# EAGLE design iot-tracker-A (EAGLE 9.4.2)
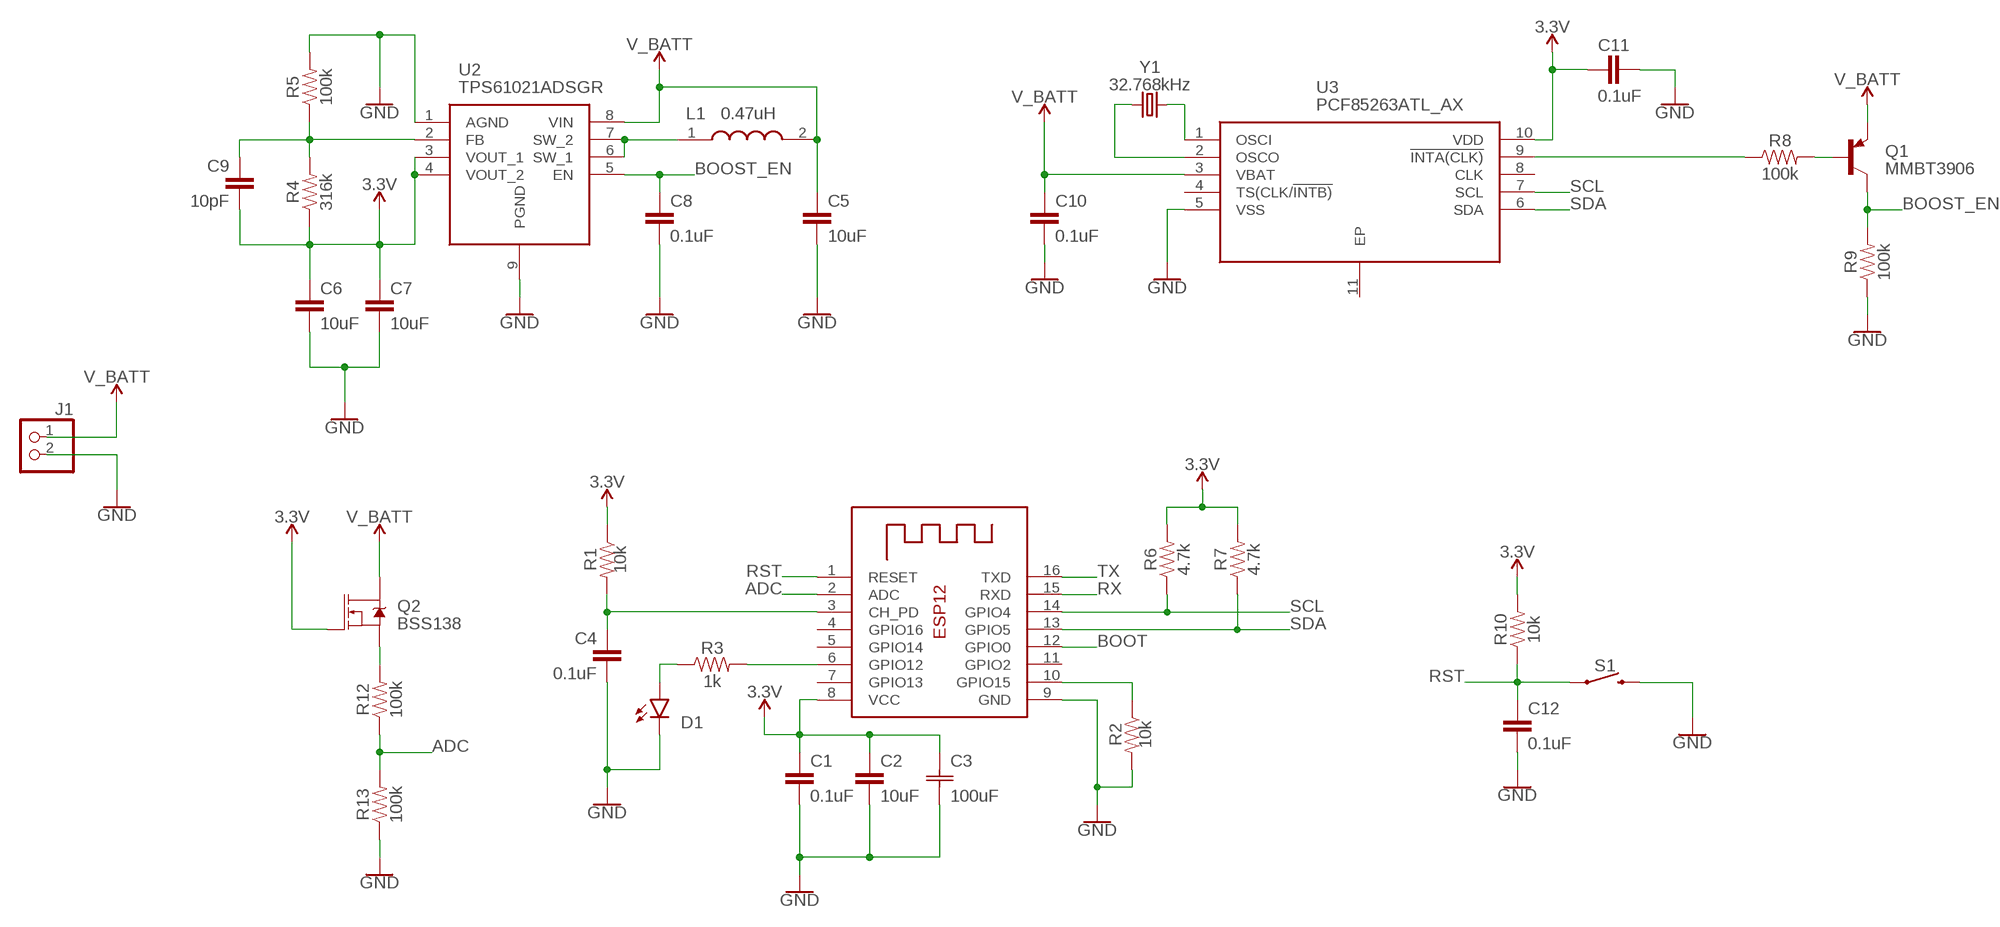
[diagram p0: schematic, sheet 1]

## Parts
C1  0.1uF  0.1UF-0603-25V-(+80/-20%)  [0603]
C2  10uF  10UF-0603-6.3V-20%  [0603]
C3  100uF  F930J107MBA  [F93-C]
C4  0.1uF  0.1UF-0603-25V-(+80/-20%)  [0603]
C5  10uF  10UF-0603-6.3V-20%  [0603]
C6  10uF  10UF-0603-6.3V-20%  [0603]
C7  10uF  10UF-0603-6.3V-20%  [0603]
C8  0.1uF  0.1UF-0603-25V-(+80/-20%)  [0603]
C9  10pF  10PF-0603-50V-5%  [0603]
C10  0.1uF  0.1UF-0603-25V-(+80/-20%)  [0603]
C11  0.1uF  0.1UF-0603-25V-(+80/-20%)  [0603]
C12  0.1uF  0.1UF-0603-25V-(+80/-20%)  [0603]
D1  LED0603  [LED-0603]
J1  PINHD-1X2  [1X02]
L1  0.47uH  DFE252012P-R47M=P2  [INDC2520X120N]
Q1  MMBT3906  MMBT3906LT1SMD  [SOT23-BEC]
Q2  BSS138  MOSFET-NCH-BSS138  [SOT23-3]
R1  10k  10KOHM-0603-1/10W-1%  [0603]
R2  10k  10KOHM-0603-1/10W-1%  [0603]
R3  1k  1KOHM-0603-1/10W-1%  [0603]
R4  316k  300KOHM-0603-1/10W-1%  [0603]
R5  100k  100KOHM-0603-1/10W-1%  [0603]
R6  4.7k  4.7KOHM-0603-1/10W-1%  [0603]
R7  4.7k  4.7KOHM-0603-1/10W-1%  [0603]
R8  100k  100KOHM-0603-1/10W-1%  [0603]
R9  100k  100KOHM-0603-1/10W-1%  [0603]
R10  10k  10KOHM-0603-1/10W-1%  [0603]
R12  100k  100KOHM-0603-1/10W-1%  [0603]
R13  100k  100KOHM-0603-1/10W-1%  [0603]
S1  MOMENTARY-SWITCH-SPST-SMD-4.6X2.8MM  [TACTILE_SWITCH_SMD_4.6X2.8MM]
U1  ESP-12  [ESP-12]
U2  TPS61021ADSGR  [SON50P200X200X80-9N]
U3  PCF85263ATL_AX  [SON50P260X260X50-11N]
Y1  32.768kHz  CRYSTAL-32.768KHZSMD-3.2X1.5  [CRYSTAL-SMD-3.2X1.5MM]

## Nets
3.3V [POWER]: C1.1 C2.1 C3.1 C6.1 C7.1 C9.2 C11.2 Q2.1(G) R1.1 R4.1 R6.2 R7.2 R10.2 U1.8(VCC) U2.3(VOUT_1) U2.4(VOUT_2) U3.10(VDD)
ADC: R12.1 R13.2 U1.2(ADC)
BOOST_EN [SIGNAL]: C8.1 Q1.C R9.2 U2.5(EN)
BOOT [SIGNAL]: U1.12(GPIO0)
ESP_EN [SIGNAL]: C4.1 R1.2 U1.3(CH_PD)
FB: C9.1 R4.2 R5.1 U2.2(FB)
GND [POWER]: C1.2 C2.2 C3.2 C4.2 C5.2 C6.2 C7.2 C8.2 C10.2 C11.1 C12.2 D1.C J1.2 R2.2 R5.2 R9.1 R13.1 S1.3 S1.4 U1.9(GND) U2.1(AGND) U2.9(PGND) U3.5(VSS)
INTA: R8.1 U3.9(!INTA(CLK))
IO15: R2.1 U1.10(GPIO15)
IO_LED: R3.2 U1.6(GPIO12)
LED_AN: D1.A R3.1
MOSFET_S: Q2.2(S) R12.2
OSCI: U3.1(OSCI) Y1.P$2
OSCO: U3.2(OSCO) Y1.P$1
PNP_B: Q1.B R8.2
RST [SIGNAL]: C12.1 R10.1 S1.1 S1.2 U1.1(RESET)
RX [DATA]: U1.15(RXD)
SCL: R6.1 U1.14(GPIO4) U3.7(SCL)
SDA: R7.1 U1.13(GPIO5) U3.6(SDA)
SW: L1.1 U2.6(SW_1) U2.7(SW_2)
TX [DATA]: U1.16(TXD)
V_BATT [POWER]: C5.1 C10.1 J1.1 L1.2 Q1.E Q2.3(D) U2.8(VIN) U3.3(VBAT)
Unconnected: U1.4(GPIO16) U1.5(GPIO14) U1.7(GPIO13) U1.11(GPIO2) U3.4(TS(CLK/!INTB)) U3.8(CLK) U3.11(EP)

## Library data of the parts
C1 C4 C8 C10-C12 = SparkFun-Capacitors:0.1UF: 0.1µF ceramic capacitors A capacitor is a passive two-terminal electrical component used to store electrical energy temporarily in an electric field.; PROD_ID: CAP-00810
C2 C5-C7 = SparkFun-Capacitors:10UF: 10.0µF ceramic capacitors A capacitor is a passive two-terminal electrical component used to store electrical energy temporarily in an electric field.; PROD_ID: CAP-11015
C3 = IOT-Tracker-A:F930J107MBA; MANUFACTURER_PART_NUMBER: F930J107MBA; VENDOR: AVX Corporation
C9 = SparkFun-Capacitors:10PF: 10pF ceramic capacitors A capacitor is a passive two-terminal electrical component used to store electrical energy temporarily in an electric field.; PROD_ID: CAP-11812
D1 = SparkFun-LED:LED: LED (Generic) Standard schematic elements and footprints for 5mm, 3mm, 1206, and 0603 sized LEDs. Generic LEDs with no color specified.
J1 = pinhead:PINHD-1X2: PIN HEADER
L1 = IOT-Tracker-A:DFE252012P-R47M=P2: Toko DFE252012P Series Shielded Wire-wound SMD Inductor with a Powered Iron Core, 470 nH Wire-Wound 6.4A Idc Source: Datasheet <https://componentsearchengine.com/Datasheets/1/DFE252012P-R47M=P2.pdf>; DESCRIPTION: Toko DFE252012P Series Shielded Wire-wound SMD Inductor with a Powered Iron Core, 470 nH Wire-Wound 6.4A Idc; HEIGHT: 1.2mm; MANUFACTURER_NAME: Murata Electronics; MANUFACTURER_PART_NUMBER: DFE252012P-R47M=P2; MOUSER_PART_NUMBER: 81-DFE252012P-R47MP2; MOUSER_PRICE-STOCK: https://www.mouser.com/Search/Refine.aspx?Keyword=81-DFE252012P-R47MP2
Q1 = transistor-pnp:MMBT3906*: PNP Transistror
Q2 = SparkFun-DiscreteSemi:MOSFET-NCH: N-channel MOSFETs Voltage controlled devices that allow control of high current outputs. SparkFun Products: SparkFun OpenScale <https://www.sparkfun.com/products/13261> SparkFun Digital Sandbox <https://www.sparkfun.com/products/12651> SparkFun Monster Moto Shield <https://www.sparkfun.com/products/10182> SparkFun MOSFET Power Controller <https://www.sparkfun.com/products/11214>; PROD_ID: TRANS-00830; VALUE: 220mA/50V/3.5Ω
R1 R2 R10 = SparkFun-Resistors:10KOHM: 10kΩ resistor A resistor is a passive two-terminal electrical component that implements electrical resistance as a circuit element. Resistors act to reduce current flow, and, at the same time, act to lower voltage levels within circuits. - Wikipedia; PROD_ID: RES-00824
R3 = SparkFun-Resistors:1KOHM: 1kΩ resistor A resistor is a passive two-terminal electrical component that implements electrical resistance as a circuit element. Resistors act to reduce current flow, and, at the same time, act to lower voltage levels within circuits. - Wikipedia; PROD_ID: RES-07856
R4 = SparkFun-Resistors:300KOHM: 300kΩ resistor A resistor is a passive two-terminal electrical component that implements electrical resistance as a circuit element. Resistors act to reduce current flow, and, at the same time, act to lower voltage levels within circuits. - Wikipedia; PROD_ID: RES-10809; VALUE: 300k
R5 R8 R9 R12 R13 = SparkFun-Resistors:100KOHM: 100kΩ resistor A resistor is a passive two-terminal electrical component that implements electrical resistance as a circuit element. Resistors act to reduce current flow, and, at the same time, act to lower voltage levels within circuits. - Wikipedia; PROD_ID: RES-07828
R6 R7 = SparkFun-Resistors:4.7KOHM: 4.7kΩ resistor A resistor is a passive two-terminal electrical component that implements electrical resistance as a circuit element. Resistors act to reduce current flow, and, at the same time, act to lower voltage levels within circuits. - Wikipedia; PROD_ID: RES-07857
S1 = SparkFun-Switches:MOMENTARY-SWITCH-SPST: Momentary Switch (Pushbutton) - SPST Normally-open (NO) SPST momentary switches (buttons, pushbuttons). Variants PTH-12MM - 12mm square, through-hole Momentary Pushbutton Switch - 12mm Square <https://www.sparkfun.com/products/9190> (COM-09190) PTH-6.0MM, PTH-6.0MM-KIT - 6.0mm square, through-hole Mini Pushbutton Switch <https://www.sparkfun.com/products/97> (COM-00097) KIT package intended for soldering kit's - only one side of pads' copper is exposed. PTH-RIGHT-ANGLE-KIT - Right-angle, through-hole Right Angle Tactile Button <https://www.sparkfun.com/products/10791> - Used on SparkFun BigTime Watch Kit <https://www.sparkfun.com/products/11734> SMD-12MM - 12mm square, surface-mount Tactile Button - SMD (12mm) <https://www.sparkfun.com/products/12993> (COM-12993) Used on SparkFun PicoBoard <https://www.sparkfun.com/products/11888> SMD-4.5MM - 4.5mm Square Trackball Switch Used on SparkFun Blackberry Trackballer Breakout <https://www.sparkfun.com/products/13169> SMD-4.6MMX2.8MM - 4.60mm x 2.80mm, surface mount Used on SparkFun SAMD21 Mini Breakout <https://www.sparkfun.com/products/13664> SMD-5.2MM, SMD-5.2-REDUNDANT - 5.2mm square, surface-mount Mini Pushbutton Switch - SMD <https://www.sparkfun.com/products/8720> (COM-08720) Used on Arduino Pro Mini <https://www.sparkfun.com/products/11114> REDUNDANT package connects both switch circuits together SMD-6.0X3.5MM - 6.0 x 3.5mm, surface mount Momentary Reset Switch SMD <https://www.sparkfun.com/products/8229> (COM-08229) SMD-6.2MM-TALL - 6.2mm square, surface mount Tactile Button - SMD (6mm) <https://www.sparkfun.com/products/12992> Used on SparkFun Digital Sandbox <https://www.sparkfun.com/products/12651> SMD-RIGHT-ANGLE - Right-angle, surface mount Used on SparkFun Block for Intel® Edison - Arduino <https://www.sparkfun.com/products/13036>; PROD_ID: SWCH-13065
U1 = IOT-Tracker-A:ESP-12
U2 = IOT-Tracker-A:TPS61021ADSGR: 3-A Boost Converter with 0.5-V Ultra Low Input Voltage Source: Datasheet <http://www.ti.com/lit/ds/symlink/tps61021a.pdf>; DESCRIPTION: 3-A Boost Converter with 0.5-V Ultra Low Input Voltage; HEIGHT: 0.8mm; MANUFACTURER_NAME: Texas Instruments; MANUFACTURER_PART_NUMBER: TPS61021ADSGR; MOUSER_PART_NUMBER: 595-TPS61021ADSGR; MOUSER_PRICE-STOCK: https://www.mouser.com/Search/Refine.aspx?Keyword=595-TPS61021ADSGR
U3 = IOT-Tracker-A:PCF85263ATL_AX: Real Time Clock Real Time Clock (I2C) Serial Source: Datasheet <https://componentsearchengine.com/Datasheets/1/PCF85263ATL_AX.pdf>; DESCRIPTION: Real Time Clock Real Time Clock (I2C) Serial; HEIGHT: 0.5mm; MANUFACTURER_NAME: Nexperia; MANUFACTURER_PART_NUMBER: PCF85263ATL/AX; MOUSER_PART_NUMBER: 771-PCF85263ATL/AX; MOUSER_PRICE-STOCK: https://www.mouser.com/Search/Refine.aspx?Keyword=771-PCF85263ATL%2FAX
Y1 = SparkFun-Clocks:CRYSTAL-32.768KHZ: 32.768kHz Crystal Frequency: 32.768kHz Frequency Stability: ±20ppm Load Capacitance: 12.5pF (PTH-2X6 & SMD-3.2X1.5), 6pF (SMD-2X6) SparkFun Products: SparkFun BigTime Watch Kit <https://www.sparkfun.com/products/11734> SparkFun nRF52832 Breakout <https://www.sparkfun.com/products/13990> SparkFun Real Time Clock Module <https://www.sparkfun.com/products/12708>; PROD_ID: XTAL-13062

## Board
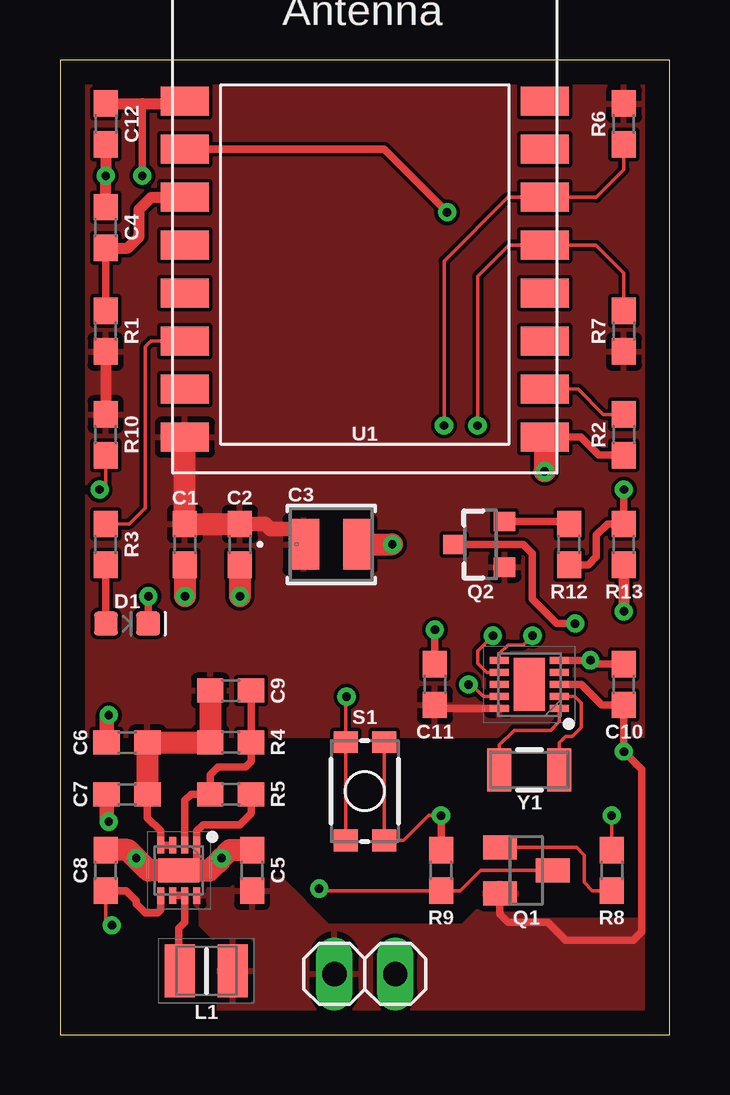
[diagram p1: board, top side]
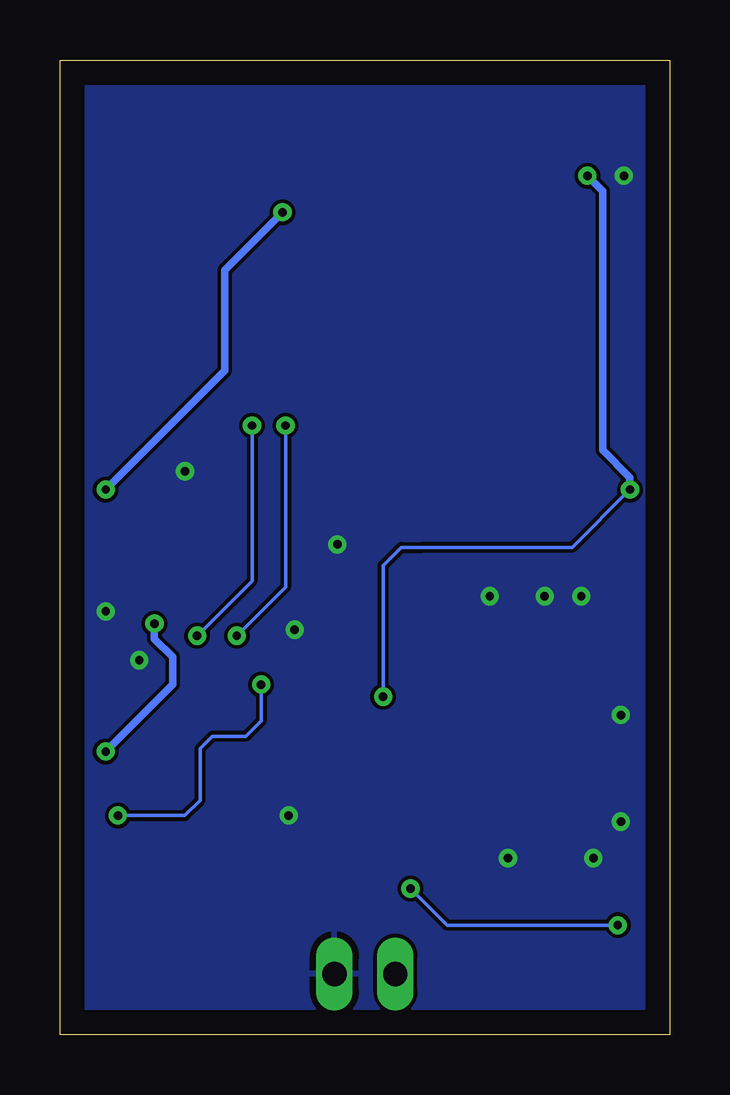
[diagram p2: board, bottom side, seen from below]

Size 25.4 x 40.64 mm. Coordinates in mm from the lower left corner, seen from the top.
Outline: 0,0 25.4,0 25.4,40.64 0,40.64 0,0
Copper layers (1*16): Top 0.035mm / dielectric 1.5mm / Bottom 0.035mm
Design rules "default": minimum track width 6mil, minimum drill 0.35mm, track to track 6mil, track to pad 6mil, pad to pad 6mil, via to via 6mil, smd to smd 6mil, copper to edge 40mil, drill to drill 6mil, minimum pad ring 10mil, minimum via ring 8mil, stop-mask expansion 4mil, vias tented up to drill 0mil, thermal gap 10mil
tRestrict: area 3.2,7.6 to 6.9,14.9; area 4.3,7.6 to 4.8,8.3

### Footprints (pad centres in the part's own frame; a part is rotated, then mirrored left to right if it is on the bottom)
0603 = smd 1.1 x 1: 1 -0.85,0; 2 0.85,0
F93-C = smd 1.27 x 2.108: 1 -1.143,0; 2 1.143,0
LED-0603 = smd 1 x 1: A -0.877,0; C 0.877,0
1X02 = drill 1.016 long: 1 -1.27,0; 2 1.27,0
INDC2520X120N = smd 1.25 x 2.2: 1 -1.1,0; 2 1.1,0
SOT23-BEC = smd 1 x 1.4: B -0.95,-1.1; C 0,1.1; E 0.95,-1.1
SOT23-3 = smd 0.8 x 0.9: 1 -0.95,-1; 2 0.95,-1; 3 0,1.1
TACTILE_SWITCH_SMD_4.6X2.8MM = smd 0.9 x 1: 1 -2.05,-0.8; 2 2.05,-0.8; 3 2.05,0.8; 4 -2.05,0.8
ESP-12 = smd 2 x 1.2: 1 -7.5,4.5; 2 -7.5,2.5; 3 -7.5,0.5; 4 -7.5,-1.5; 5 -7.5,-3.5; 6 -7.5,-5.5; 7 -7.5,-7.5; 8 -7.5,-9.5; 9 7.5,-9.5; 10 7.5,-7.5; 11 7.5,-5.5; 12 7.5,-3.5; 13 7.5,-1.5; 14 7.5,0.5; 15 7.5,2.5; 16 7.5,4.5
SON50P200X200X80-9N = smd 0.7 x 0.3: 1 -1.05,0.75; 2 -1.05,0.25; 3 -1.05,-0.25; 4 -1.05,-0.75; 5 1.05,-0.75; 6 1.05,-0.25; 7 1.05,0.25; 8 1.05,0.75 | smd 1 x 1.7: 9 0,0
SON50P260X260X50-11N = smd 0.8 x 0.3: 1 -1.25,1; 2 -1.25,0.5; 3 -1.25,0; 4 -1.25,-0.5; 5 -1.25,-1; 6 1.25,-1; 7 1.25,-0.5; 8 1.25,0; 9 1.25,0.5; 10 1.25,1 | smd 1.3 x 2.2: 11 0,0
CRYSTAL-SMD-3.2X1.5MM = smd 1 x 1.8: P$1 -1.25,0; P$2 1.25,0

### Placement (x,y rotation side)
C1  5.21,20.45 270 top
C2  7.49,20.45 270 top
C3  11.3,20.45 0 top
C4  1.91,33.66 90 top
C5  8,6.86 90 top
C6  2.79,12.19 180 top
C7  2.79,10.03 180 top
C8  1.91,6.86 90 top
C9  7.11,14.35 180 top
C10  23.5,14.61 90 top
C11  15.62,14.61 270 top
C12  1.91,37.97 270 top
D1  2.79,17.14 0 top
J1  12.7,2.54 0 top
L1  6.1,2.67 0 top
Q1  19.43,6.86 270 top
Q2  17.53,20.45 90 top
R1  1.91,29.34 90 top
R2  23.5,25.02 270 top
R3  1.91,20.45 90 top
R4  7.11,12.19 0 top
R5  7.11,10.03 0 top
R6  23.5,37.97 90 top
R7  23.5,29.34 270 top
R8  22.99,6.86 270 top
R9  15.88,6.86 270 top
R10  1.91,25.02 90 top
R12  21.21,20.45 90 top
R13  23.5,20.45 90 top
S1  12.7,10.16 270 top
U1  12.7,34.42 0 top
U2  4.95,6.86 270 top
U3  19.56,14.61 180 top
Y1  19.56,11.05 180 top

### Tracks (layer width: path | path; a pad name or v marks a point on that pad's centre or on a via)
3.3V
  Top 0.305: U3.10 15.77,13.61 C11.2 | U2.3 U2.4 4.2,8.5 3.64,9.06 C7.1
  Top 0.457: R1.1 R10.2
  Top 0.61: C2.1 8.55,21.3 8.76,21.08 9.65,21.08 10.16,20.57 C3.1
  Top 0.914: U1.8 C1.1 C2.1 | C7.1 C6.1 R4.1 C9.2
  pour Top (isolate 0.001): 25.4,40.64 0,40.64 0,12.45 25.4,12.45
ADC  (via drill 0.35)
  Top 0.305: R12.1 22.01,19.6 22.35,19.94 22.35,20.83 22.82,21.3 R13.2 v23.5,22.73 | U1.2 13.5,36.92 v16.13,34.29
  Bottom 0.305: v23.5,22.73 18.54,27.69 18.54,31.88 v16.13,34.29
BOOST_EN  (via drill 0.35)
  Top 0.152: Q1.C 17.53,6.86 16.68,6.01 R9.2 10.88,6.01 v10.79,6.1 | C8.1 1.91,4.83 v2.16,4.57
  Top 0.305: U2.5 4.2,5.22 4.06,5.08 3.56,5.08 3.17,5.46 3.17,5.59 2.75,6.01 C8.1
  Bottom 0.152: v2.16,4.57 9.27,4.57 v10.79,6.1
ESP_EN
  Top 0.305: C4.1 R1.2
  Top 0.457: C4.1 2.83,32.81 3.3,33.27 3.3,34.42 3.8,34.92 U1.3
FB
  Top 0.305: C9.1 R4.2 7.96,11.39 7.75,11.18 6.6,11.18 6.26,10.83 R5.1 5.46,10.03 5.2,9.77 U2.2
GND  (via drill 0.35)
  Top 0.152: S1.4 S1.3 14.33,8.11 15.37,9.14 v15.88,9.14
  Top 0.305: R2.2 22.44,24.17 21.69,24.92 U1.9 | D1.C 3.67,18.28 v3.68,18.29 | U3.5 22.08,15.61 | 22.08,15.61 v22.1,15.62 | C10.2 22.23,15.45 22.08,15.61 | C11.1 v15.62,16.89 | 5.71,6.86 5.7,6.87 U2.1 5.7,8.5 5.97,8.76 7.49,8.76 7.96,9.23 R5.2 | R9.1 v15.88,9.14
  Top 0.457: C12.2 v1.91,35.81 C4.2 | R13.1 v23.5,17.65
  Top 0.61: C7.2 1.94,8.98 v2.03,8.89 | C6.2 1.94,13.25 v2.03,13.34
  Top 0.914: U1.9 v20.2,23.5 v20.19,23.5 | C3.2 v13.84,20.45 | C1.2 v5.21,18.29 | C2.2 v7.49,18.29 | C8.2 2.83,7.71 v3.17,7.37 3.68,6.86 U2.9 5.71,6.86 6.22,6.86 v6.73,7.37 7.07,7.71 C5.2
  pour Bottom: 0,40.64 25.4,40.64 25.4,0 0,0
INTA  (via drill 0.35)
  Top 0.152: R8.1 v22.99,9.14 | U3.9 17.64,14.11 17.14,14.61 v17.02,14.61
  Bottom 0.152: v22.99,9.14 20.19,9.14 19.56,9.78 19.56,11.94 19.05,12.45 17.65,12.45 17.02,13.08 v17.02,14.61
IO15
  Top 0.152: U1.10 21.6,26.92 22.64,25.87 R2.1
IO_LED
  Top 0.152: R3.2 2.88,21.3 3.56,21.97 3.56,28.7 3.77,28.92 U1.6
LED_AN
  Top 0.305: R3.1 1.91,17.16 D1.A
MOSFET_S
  Top 0.305: Q2.2 21.11,21.4 R12.2
OSCI
  Top 0.152: U3.1 20.81,13.06 20.45,12.7 18.92,12.7 18.31,12.09 Y1.P$2
OSCO
  Top 0.152: U3.2 21.45,14.11 21.72,13.84 21.72,12.83 21.34,12.45 21.08,12.45 20.81,12.17 Y1.P$1
PNP_B
  Top 0.152: Q1.B 21.53,7.81 21.84,7.49 21.84,6.35 22.19,6.01 R8.2
RST  (via drill 0.35)
  Top 0.152: R10.1 1.91,22.99 v1.65,22.73 | S1.2 S1.1 11.9,14.06 v11.94,14.1
  Top 0.305: v3.43,35.81 3.43,38.82
  Top 0.457: C12.1 3.43,38.82 5.11,38.82 U1.1
  Bottom 0.152: v1.65,22.73 4.06,20.32 10.16,20.32 10.29,20.32 11.18,20.32 11.94,19.56 v11.94,14.1
  Bottom 0.305: v1.65,22.73 1.65,23.24 2.79,24.38 2.79,35.18 v3.43,35.81
SCL  (via drill 0.35)
  Top 0.152: R6.1 23.5,36.07 22.34,34.92 U1.14 18.66,34.92 16,32.26 v16,25.4 | U3.7 17.79,15.11 17.4,15.49 17.4,16 v18.03,16.64
  Bottom 0.152: v16,25.4 16,18.67 v18.03,16.64
SDA  (via drill 0.35)
  Top 0.152: R7.1 23.5,31.75 22.33,32.92 U1.13 18.69,32.92 17.4,31.62 v17.4,25.4 | U3.6 18.31,15.89 18.67,16.26 19.3,16.26 v19.68,16.64
  Bottom 0.152: v17.4,25.4 17.4,18.92 v19.68,16.64
SW
  Top 0.305: U2.6 U2.7 5.2,4.7 4.95,4.45 4.95,2.71 L1.1
V_BATT  (via drill 0.35)
  Top 0.305: U3.3 21.72,14.61 22.57,13.75 C10.1 v23.5,11.81 24.23,11.07 24.23,4.29 23.88,3.94 21.08,3.94 20.32,4.7 18.67,4.7 18.33,5.04 Q1.E | Q2.3 19.3,20.45 19.68,20.07 19.68,18.16 20.7,17.14 v21.46,17.14
  Bottom 0.305: v21.46,17.14 21.46,16.51 20.7,15.75 20.7,14.61 v23.5,11.81
  pour Top (isolate 0.001): 5.59,6.1 5.59,5.46 5.84,5.21 5.84,4.57 6.6,3.81 6.6,0 25.4,0 25.4,4.83 21.34,4.83 19.43,4.83 19.05,5.21 19.05,6.35 17.65,6.35 17.65,5.46 16.76,4.57 14.99,4.57 11.18,4.57 9.27,6.48 7.49,6.48 7.11,6.1